# Altium schematic sheet Gate_Driver_Supply.SchDoc
size A4; SheetNumber: 6; SheetTotal: 9
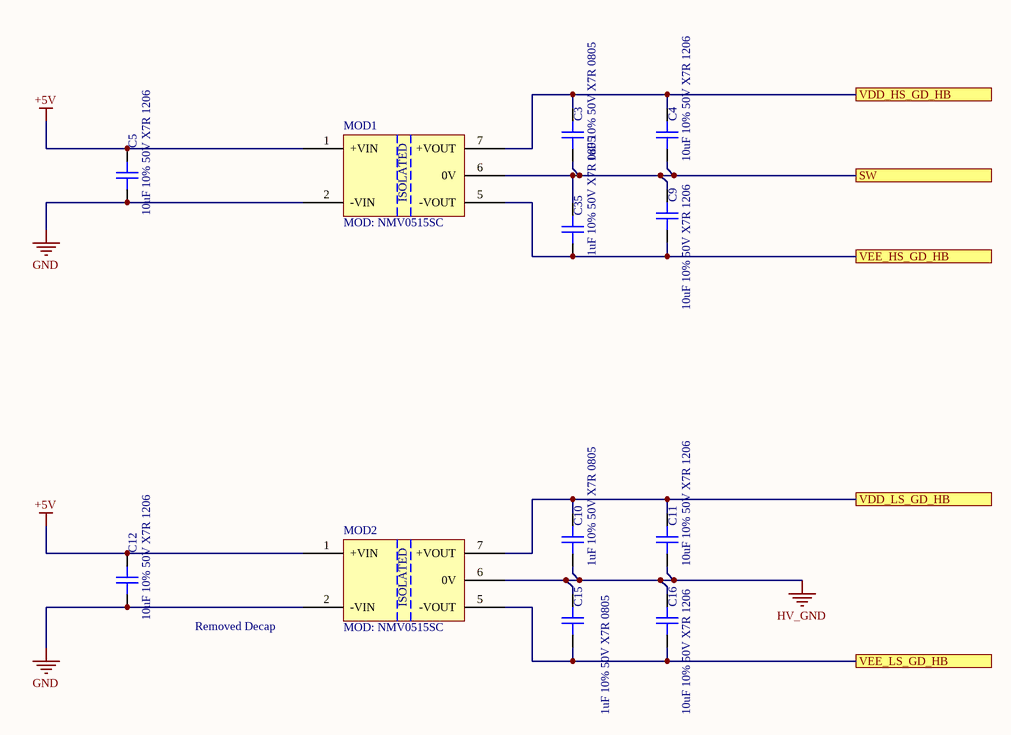
[diagram p0: Gate_Driver_Supply.SchDoc]

## Parts
C3  1uF 10% 50V X7R 0805  [CAPC2012X10N]
C4  10uF 10% 50V X7R 1206  [CAPC3216X18N]
C5  10uF 10% 50V X7R 1206  [CAPC3216X18N]
C9  10uF 10% 50V X7R 1206  [CAPC3216X18N]
C10  1uF 10% 50V X7R 0805  [CAPC2012X10N]
C11  10uF 10% 50V X7R 1206  [CAPC3216X18N]
C12  10uF 10% 50V X7R 1206  [CAPC3216X18N]
C15  1uF 10% 50V X7R 0805  [CAPC2012X10N]
C16  10uF 10% 50V X7R 1206  [CAPC3216X18N]
C35  1uF 10% 50V X7R 0805  [CAPC2012X10N]
MOD1  MOD: NMV0515SC  [MOD: NMV0515SC]
MOD2  MOD: NMV0515SC  [MOD: NMV0515SC]

## Ports
SW (see Gate_Driver[1A]), VDD_HS_GD_HB (see Gate_Driver[1A]), VDD_LS_GD_HB (see Gate_Driver[1A]), VEE_HS_GD_HB (see Gate_Driver[1A]), VEE_LS_GD_HB (see Gate_Driver[1A])

## Nets
+5V: C5.2 C12.2 MOD1.1(+VIN) MOD2.1(+VIN)
GND: C5.1 C12.1 MOD1.2(-VIN) MOD2.2(-VIN)
HV_GND: C10.1 C11.1 C15.2 C16.2 MOD2.6(0V)
SW: C3.1 C4.1 C9.2 C35.2 MOD1.6(0V) ; port SW
VDD_HS_GD_HB: C3.2 C4.2 MOD1.7(+VOUT) ; port VDD_HS_GD_HB
VDD_LS_GD_HB: C10.2 C11.2 MOD2.7(+VOUT) ; port VDD_LS_GD_HB
VEE_HS_GD_HB: C9.1 C35.1 MOD1.5(-VOUT) ; port VEE_HS_GD_HB
VEE_LS_GD_HB: C15.1 C16.1 MOD2.5(-VOUT) ; port VEE_LS_GD_HB

## Notes on the sheet
- Removed Decap
- (in symbol CMP-00247-2) ISOLATED

## Library data of the parts
C3 C10 C15 C35 = CMP-001-00047-1: Ceramic Capacitor, Multilayer, Ceramic, 50V, 10% +Tol, 10% -Tol, X7R, 15% TC, 1uF, Surface Mount, 0805; Manufacturer Part Number: C2012X7R1H105K125AB; Manufacturer: TDK; Manufacturer Lifecycle Status: PRODUCTION; Value: 1µF; Min Length: 3.1mm; Dielectric: X7R; Category: Ceramic Capacitors; Number of Terminals: 2; Max Length: 3.5mm; Height: 1.6mm; Length: 3.2mm; Introduction Date: 2018-03-29; Harmonized Tariff Schedule (HTS) Code: 8532.24.00.20; Case/Package: 0805; ComponentLink2URL: https://datasheet.octopart.com:443/C3216X7R1H106K160AC-TDK-datasheet-182135025.pdf?src-supplier=TME; Max Width: 1.9mm; Thickness: 1.6mm; Pricing: 100=3,09, 250=2,81, 500=2,35, 1000=2,2, 2000=1,97 (DKK); ComponentLink4Description: https://datasheet.octopart.com:443/C3216X7R1H106K160AC-TDK-datasheet-151546523.pdf?src-supplier=ODG+(Origin+Data+Global); ComponentLink5Description: https://datasheet.octopart.com/C3216X7R1H106K160AC-TDK-datasheet-41194876.pdf; ComponentLink5URL: https://datasheet.octopart.com/C3216X7R1H106K160AC-TDK-datasheet-41194876.pdf; ComponentLink3Description: https://datasheet.octopart.com:443/C3216X7R1H106K160AC-TDK-datasheet-159617022.pdf?src-supplier=TME; Min Operating Temperature: -55°C; RoHS: Compliant; Max Operating Temperature: 125°C; Lead Free: Lead Free; Material: Ceramic; ComponentLink3URL: https://datasheet.octopart.com:443/C3216X7R1H106K160AC-TDK-datasheet-159617022.pdf?src-supplier=TME; Stock: 26276; Source: MasterLibrary_SCH.SchLib; Export Control Classification Number (ECCN) Code: EAR99; Case Code (Metric): 2012; Voltage Rating: 50V; China RoHS: Compliant; Design Item ID: 1uF 10% 50V X7R 0805; Lifecycle Status: Production; Voltage Rating (DC): 50V; Width: 1.6mm; ComponentLink4URL: https://datasheet.octopart.com:443/C3216X7R1H106K160AC-TDK-datasheet-151546523.pdf?src-supplier=ODG+(Origin+Data+Global); Dielectric Material: Ceramic; ComponentLink2Description: https://datasheet.octopart.com:443/C3216X7R1H106K160AC-TDK-datasheet-182135025.pdf?src-supplier=TME; ComponentLink1URL: https://datasheet.octopart.com:443/C3216X7R1H106K160AC-TDK-datasheet-175423548.pdf?src-supplier=TME; Min Width: 1.5mm; ComponentLink1Description: https://datasheet.octopart.com:443/C3216X7R1H106K160AC-TDK-datasheet-175423548.pdf?src-supplier=TME; REACH SVHC: Yes; Mounting Technology: Surface Mount
C4 C9 C11 C16 = CMP-001-00049-1: Ceramic Capacitor, Multilayer, Ceramic, 50V, 10% +Tol, 10% -Tol, X7R, 15% TC, 10uF, Surface Mount, 1206; Manufacturer Part Number: C3216X7R1H106K160AC; Manufacturer: TDK; Manufacturer Lifecycle Status: PRODUCTION; Value: 10µF; ComponentLink3Description: https://datasheet.octopart.com:443/C3216X7R1H106K160AC-TDK-datasheet-159617022.pdf?src-supplier=TME; ComponentLink3URL: https://datasheet.octopart.com:443/C3216X7R1H106K160AC-TDK-datasheet-159617022.pdf?src-supplier=TME; China RoHS: Compliant; Case Code (Metric): 3216; ComponentLink2URL: https://datasheet.octopart.com:443/C3216X7R1H106K160AC-TDK-datasheet-182135025.pdf?src-supplier=TME; Mounting Technology: Surface Mount; Dielectric: X7R; Material: Ceramic; RoHS: Compliant; Introduction Date: 2018-03-29; Design Item ID: 10uF 10% 50V X7R 1206; Max Length: 3.5mm; ComponentLink4URL: https://datasheet.octopart.com:443/C3216X7R1H106K160AC-TDK-datasheet-151546523.pdf?src-supplier=ODG+(Origin+Data+Global); Length: 3.2mm; Height: 1.6mm; Harmonized Tariff Schedule (HTS) Code: 8532.24.00.20; Lifecycle Status: Production; ComponentLink1Description: https://datasheet.octopart.com:443/C3216X7R1H106K160AC-TDK-datasheet-175423548.pdf?src-supplier=TME; Width: 1.6mm; Min Length: 3.1mm; Min Operating Temperature: -55°C; Number of Terminals: 2; ComponentLink4Description: https://datasheet.octopart.com:443/C3216X7R1H106K160AC-TDK-datasheet-151546523.pdf?src-supplier=ODG+(Origin+Data+Global); Dielectric Material: Ceramic; Source: MasterLibrary_SCH.SchLib; Lead Free: Lead Free; Category: Ceramic Capacitors; ComponentLink5URL: https://datasheet.octopart.com/C3216X7R1H106K160AC-TDK-datasheet-41194876.pdf; ComponentLink5Description: https://datasheet.octopart.com/C3216X7R1H106K160AC-TDK-datasheet-41194876.pdf; Schedule B: 8532240020, 8532240020; Case/Package: 1206; Max Width: 1.9mm; Stock: 26276; Min Width: 1.5mm; Thickness: 1.6mm; ComponentLink1URL: https://datasheet.octopart.com:443/C3216X7R1H106K160AC-TDK-datasheet-175423548.pdf?src-supplier=TME; Pricing: 100=3,09, 250=2,81, 500=2,35, 1000=2,2, 2000=1,97 (DKK); Max Operating Temperature: 125°C; ComponentLink2Description: https://datasheet.octopart.com:443/C3216X7R1H106K160AC-TDK-datasheet-182135025.pdf?src-supplier=TME; Voltage Rating: 50V; REACH SVHC: Yes; Voltage Rating (DC): 50V; Export Control Classification Number (ECCN) Code: EAR99
C5 C12 = CMP-001-00049-1: Ceramic Capacitor, Multilayer, Ceramic, 50V, 10% +Tol, 10% -Tol, X7R, 15% TC, 10uF, Surface Mount, 1206; Manufacturer Part Number: C3216X7R1H106K160AC; Manufacturer Lifecycle Status: PRODUCTION; Manufacturer: TDK; Value: 10µF; ComponentLink4URL: https://datasheet.octopart.com:443/C3216X7R1H106K160AC-TDK-datasheet-151546523.pdf?src-supplier=ODG+(Origin+Data+Global); Voltage Rating (DC): 50V; ComponentLink3Description: https://datasheet.octopart.com:443/C3216X7R1H106K160AC-TDK-datasheet-159617022.pdf?src-supplier=TME; Max Operating Temperature: 125°C; Thickness: 1.6mm; Category: Ceramic Capacitors; Design Item ID: 10uF 10% 50V X7R 1206; China RoHS: Compliant; Source: MasterLibrary_SCH.SchLib; Mounting Technology: Surface Mount; Stock: 26276; Min Length: 3.1mm; Lead Free: Lead Free; Min Operating Temperature: -55°C; RoHS: Compliant; Pricing: 100=3,09, 250=2,81, 500=2,35, 1000=2,2, 2000=1,97 (DKK); Width: 1.6mm; ComponentLink2URL: https://datasheet.octopart.com:443/C3216X7R1H106K160AC-TDK-datasheet-182135025.pdf?src-supplier=TME; REACH SVHC: Yes; Max Length: 3.5mm; Case/Package: 1206; ComponentLink1URL: https://datasheet.octopart.com:443/C3216X7R1H106K160AC-TDK-datasheet-175423548.pdf?src-supplier=TME; Max Width: 1.9mm; Height: 1.6mm; ComponentLink3URL: https://datasheet.octopart.com:443/C3216X7R1H106K160AC-TDK-datasheet-159617022.pdf?src-supplier=TME; Number of Terminals: 2; Case Code (Metric): 3216; Dielectric Material: Ceramic; ComponentLink2Description: https://datasheet.octopart.com:443/C3216X7R1H106K160AC-TDK-datasheet-182135025.pdf?src-supplier=TME; Lifecycle Status: Production; Voltage Rating: 50V; Material: Ceramic; ComponentLink4Description: https://datasheet.octopart.com:443/C3216X7R1H106K160AC-TDK-datasheet-151546523.pdf?src-supplier=ODG+(Origin+Data+Global); Min Width: 1.5mm; Introduction Date: 2018-03-29; Export Control Classification Number (ECCN) Code: EAR99; Length: 3.2mm; ComponentLink1Description: https://datasheet.octopart.com:443/C3216X7R1H106K160AC-TDK-datasheet-175423548.pdf?src-supplier=TME; Schedule B: 8532240020, 8532240020; Harmonized Tariff Schedule (HTS) Code: 8532.24.00.20; Dielectric: X7R; ComponentLink5URL: https://datasheet.octopart.com/C3216X7R1H106K160AC-TDK-datasheet-41194876.pdf; ComponentLink5Description: https://datasheet.octopart.com/C3216X7R1H106K160AC-TDK-datasheet-41194876.pdf
MOD1 MOD2 = CMP-00247-2: Module DC-DC 5VIN 2-OUT 15V/-15V 0.033A/-0.033A 1W 5-Pin SIP Tube; Manufacturer: Murata Power Solutions; Min Input Voltage (DC): 4.5V; Output Voltage: 15V; Output Current: 33mA; Isolation: Isolated; Number of Outputs: 2; Isolation Voltage: 3kV; Max Supply Voltage: 5.5V; Current - Output 2: -33mA; Voltage - Output 2: -15V; Efficiency: 79%; Nominal Supply Voltage: 5V; Number of Circuits: 1; ComponentLink28Description: https://www.recom-power.com/pdf/Powerline-DC-DC/RP240H-RW.pdf?src-supplier=Digi-Key; ComponentLink20Description: https://datasheet.ciiva.com/29184/676157-da-01-en-dc-dc-wandler-r-78hb5-0-0-5l-29184439.pdf?src-supplier=Conrad; ComponentLink1Description: https://datasheet.octopart.com:443/NMV0515SC-Murata-Power-Solutions-datasheet-180811994.pdf?src-supplier=IHS; ComponentLink29Description: https://www.recom-power.com/pdf/Powerline-DC-DC/RPA60-FW.pdf?src-supplier=Digi-Key; ComponentLink5Description: https://datasheet.octopart.com:443/NMV0515SC-Murata-Power-Solutions-datasheet-12521135.pdf?src-supplier=Newark; ComponentLink8Description: https://datasheet.octopart.com:443/NMV0515SC-Murata-datasheet-141294565.pdf?src-supplier=Ciiva; Min Supply Voltage: 4.5V; Pricing: 1=1797.05, 5=1743.14, 10=1689.21, 25=1635.28, 50=1581.42 (DKK); Design Item ID: MOD: NMV0515SC; ComponentLink6Description: https://datasheet.octopart.com:443/NMV0515SC-Murata-Power-Solutions-datasheet-81845694.pdf?src-supplier=Newark; Schedule B: 8542390000, 8542390000; ComponentLink15Description: https://datasheet.ciiva.com/2172/rnm-2172491.pdf?src-supplier=Digi-Key; ComponentLink2Description: https://datasheet.octopart.com:443/NMV0515SC-Murata-Power-Solutions-datasheet-10084750.pdf?src-supplier=element14+APAC; ComponentLink17Description: https://datasheet.ciiva.com/2374/r-78hbxx-0-5-l-2374159.pdf?src-supplier=Digi-Key; ComponentLink23Description: https://datasheet.ciiva.com/5783/tclt1000-5783658.pdf?src-supplier=Farnell; Max Output Power: 1W; ComponentLink3Description: https://datasheet.octopart.com:443/NMV0515SC-Murata-Power-Solutions-datasheet-6396052.pdf?src-supplier=element14+APAC; Category: Board Mount Modules; ComponentLink9URL: https://datasheet.octopart.com:443/NMV0515SC-Murata-datasheet-1208.pdf?src-supplier=Farnell; Terminal Pitch: 2.54mm; ComponentLink1URL: https://datasheet.octopart.com:443/NMV0515SC-Murata-Power-Solutions-datasheet-180811994.pdf?src-supplier=IHS; Max Output Current: 33mA; Flammability Rating: UL94 V-0; REACH SVHC: Yes; Pins: 5; Case/Package: SIP; ComponentLink7URL: https://datasheet.octopart.com:443/NMV0515SC-Murata-datasheet-142546881.pdf?src-supplier=Ciiva; Mounting Technology: Through Hole; ComponentLink12Description: https://datasheet.ciiva.com/16493/tclt1000-16493446.pdf?src-supplier=Future+Electronics; ComponentLink22Description: https://datasheet.ciiva.com/4645/r-78hbxx-0-5-l-226048-4645094.pdf?src-supplier=Mouser; Depth: 6mm; ComponentLink10Description: http://sigma.octopart.com:80/reach_statement/Murata-company-16.pdf?src-supplier=Compliance+Statements; Lead Free: Lead Free; Length: 19.5mm; ComponentLink2URL: https://datasheet.octopart.com:443/NMV0515SC-Murata-Power-Solutions-datasheet-10084750.pdf?src-supplier=element14+APAC; Voltage - Output 1: 15V; Max Operating Temperature: 85°C; Stock: 15; ComponentLink27Description: https://katalog.we-online.de/pm/datasheet/173010542.pdf?src-supplier=Digi-Key; ComponentLink4URL: https://datasheet.octopart.com:443/NMV0515SC-Murata-Power-Solutions-datasheet-68536991.pdf?src-supplier=element14+APAC; Number of Terminals: 5; ComponentLink24Description: https://datasheet.ciiva.com/6573/s-110-cny17-6573733.pdf?src-supplier=Digi-Key; ComponentLink10URL: http://sigma.octopart.com:80/reach_statement/Murata-company-16.pdf?src-supplier=Compliance+Statements; Source: MasterLibrary_SCH.SchLib; ComponentLink4Description: https://datasheet.octopart.com:443/NMV0515SC-Murata-Power-Solutions-datasheet-68536991.pdf?src-supplier=element14+APAC; Min Operating Temperature: -40°C; RoHS: Compliant; ComponentLink9Description: https://datasheet.octopart.com:443/NMV0515SC-Murata-datasheet-1208.pdf?src-supplier=Farnell; ComponentLink6URL: https://datasheet.octopart.com:443/NMV0515SC-Murata-Power-Solutions-datasheet-81845694.pdf?src-supplier=Newark; Nominal Output Voltage: 15V; Power Rating: 1W; Lifecycle Status: Production; ComponentLink26Description: https://datasheet.ciiva.com/8091/tclt1000-8091688.pdf?src-supplier=Avnet; Output Power: 1W; ComponentLink21Description: https://datasheet.ciiva.com/3148/adum5240-5241-5242-3148379.pdf?src-supplier=Avnet; ComponentLink30Description: Where buy it; ComponentLink18Description: https://datasheet.ciiva.com/26321/tclt1000-26321177.pdf?src-supplier=Element14; ComponentLink14Description: https://datasheet.ciiva.com/2081/adum5240-5241-5242-2081908.pdf?src-supplier=Digi-Key; ComponentLink5URL: https://datasheet.octopart.com:443/NMV0515SC-Murata-Power-Solutions-datasheet-12521135.pdf?src-supplier=Newark; Max Power Dissipation: 1W; Radiation Hardening: No; Manufacturer Part Number: NMV0515SC; ComponentLink16Description: https://datasheet.ciiva.com/2172/rnm-2172495.pdf?src-supplier=Digi-Key; ComponentLink13Description: https://datasheet.ciiva.com/16618/adum5240-5241-5242-16618062.pdf?src-supplier=Avnet+Europe; ComponentLink8URL: https://datasheet.octopart.com:443/NMV0515SC-Murata-datasheet-141294565.pdf?src-supplier=Ciiva; ComponentLink19Description: https://datasheet.ciiva.com/26911/adum5242arz-26911858.pdf?src-supplier=IIIC; China RoHS: Non-Compliant; ComponentLink25Description: https://datasheet.ciiva.com/8040/52022-8040864.pdf?src-supplier=Element14; ComponentLink11Description: https://datasheet.ciiva.com/15134/getdatasheetpartid-67812-15134142.pdf?src-supplier=Verical; ComponentLink7Description: https://datasheet.octopart.com:443/NMV0515SC-Murata-datasheet-142546881.pdf?src-supplier=Ciiva; ComponentLink3URL: https://datasheet.octopart.com:443/NMV0515SC-Murata-Power-Solutions-datasheet-6396052.pdf?src-supplier=element14+APAC; Current - Output 1: 33mA